# Altium schematic sheet RS232.SchDoc
size A4; SheetNumber: 2; SheetTotal: 14
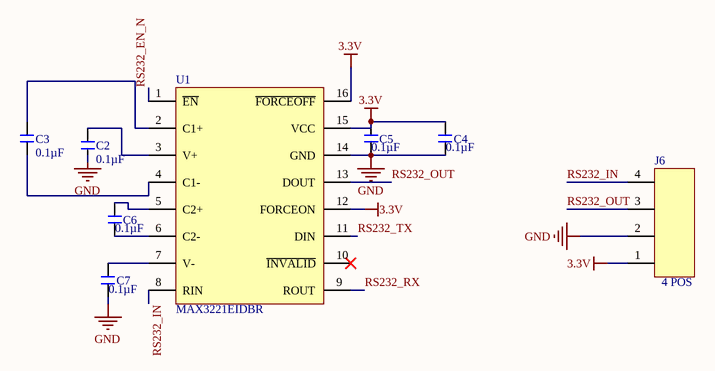
[diagram p0: RS232.SchDoc]

## Parts
C2  value 0.1µF  [402 capacitor - duplicate]  (hidden comment: 0402 capacitor)
C3  value 0.1µF  [402 capacitor - duplicate]  (hidden comment: 0402 capacitor)
C4  value 0.1µF  [402 capacitor - duplicate]  (hidden comment: 0402 capacitor)
C5  value 0.1µF  [402 capacitor - duplicate]  (hidden comment: 0402 capacitor)
C6  value 0.1µF  [402 capacitor - duplicate]  (hidden comment: 0402 capacitor)
C7  value 0.1µF  [402 capacitor - duplicate]  (hidden comment: 0402 capacitor)
J6  4 POS  [0901362104]
U1  MAX3221EIDBR  [MAX3221EIDBR]

## Nets
3.3V: C4.2 C5.2 J6.1 U1.12(FORCEON) U1.15(VCC) U1.16(~{FORCEOFF})
GND: C2.1 C4.1 C5.1 C7.1 J6.2 U1.14(GND)
RS232_EN_N: U1.1(~{EN})
RS232_IN: J6.4 U1.8(RIN)
RS232_OUT: J6.3 U1.13(DOUT)
RS232_RX: U1.9(ROUT)
RS232_TX: U1.11(DIN)
NetC2_2: C2.2 U1.3(V+)
NetC3_1: C3.1 U1.4(C1-)
NetC3_2: C3.2 U1.2(C1+)
NetC6_1: C6.1 U1.6(C2-)
NetC6_2: C6.2 U1.5(C2+)
NetC7_2: C7.2 U1.7(V-)

Not connected (* = marked no-connect by the designer): U1 10(~{INVALID})*

## Library data of the parts
C2-C7 = CAP SMD 402: MPN: CL05A104KA5NNNC; Package: 0402
J6 = 0901362104: CONN HEADER R/A 4POS 2.54MM; MPN: 0901362104
U1 = MAX3221EIDBR: IC TRANSCEIVER FULL 1/1 16SSOP (±5V i±15V - 3kΩ 7kΩ); MPN: MAX3221EIDBR